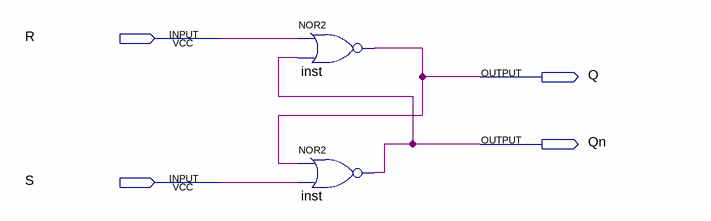
[diagram p0: schematic sheet]
// Quartus schematic lab9step1a.bdf as structural Verilog: 2 symbols, 4 pins
module lab9step1a (
  input  R,
  input  S,
  output Q,
  output Qn
);

  nor inst (Q, R, Qn);
  nor inst_dup2 (Qn, Q, S);
endmodule
